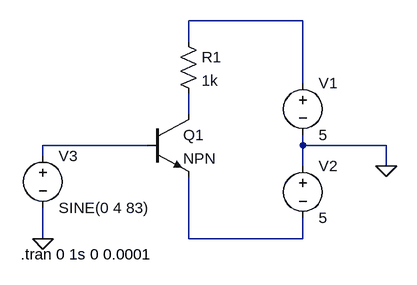
[diagram p0: schematic Draft3.asc]
Draft3.asc, the LTspice schematic file:
Version 4
SHEET 1 880 680
WIRE 368 0 192 0
WIRE 192 32 192 0
WIRE 368 96 368 0
WIRE 192 144 192 112
WIRE 128 192 -32 192
WIRE 368 192 368 176
WIRE 496 192 368 192
WIRE -32 208 -32 192
WIRE 368 224 368 192
WIRE 496 224 496 192
WIRE -32 336 -32 288
WIRE 192 336 192 240
WIRE 368 336 368 304
WIRE 368 336 192 336
FLAG -32 336 0
FLAG 496 224 0
SYMBOL npn 128 144 R0
SYMATTR InstName Q1
SYMBOL voltage 368 80 R0
WINDOW 123 0 0 Left 2
WINDOW 39 0 0 Left 2
SYMATTR InstName V1
SYMATTR Value 5
SYMBOL voltage 368 208 R0
WINDOW 123 0 0 Left 2
WINDOW 39 0 0 Left 2
SYMATTR InstName V2
SYMATTR Value 5
SYMBOL voltage -32 192 R0
WINDOW 123 0 0 Left 2
WINDOW 39 0 0 Left 2
SYMATTR InstName V3
SYMATTR Value SINE(0 4 83)
SYMBOL res 176 16 R0
SYMATTR InstName R1
SYMATTR Value 1k
TEXT -66 360 Left 2 !.tran 0 1s 0 0.0001

The netlist it stands for:
* Draft3.asc
Q1 N002 N003 N004 0 NPN
V1 N001 0 5
V2 0 N004 5
V3 N003 0 SINE(0 4 83)
R1 N001 N002 1k
.model NPN NPN
.model PNP PNP
.lib standard.bjt
.tran 0 1s 0 0.0001
.backanno
.end